# EAGLE design C64_Kernal_Switch (EAGLE 9.2.2)
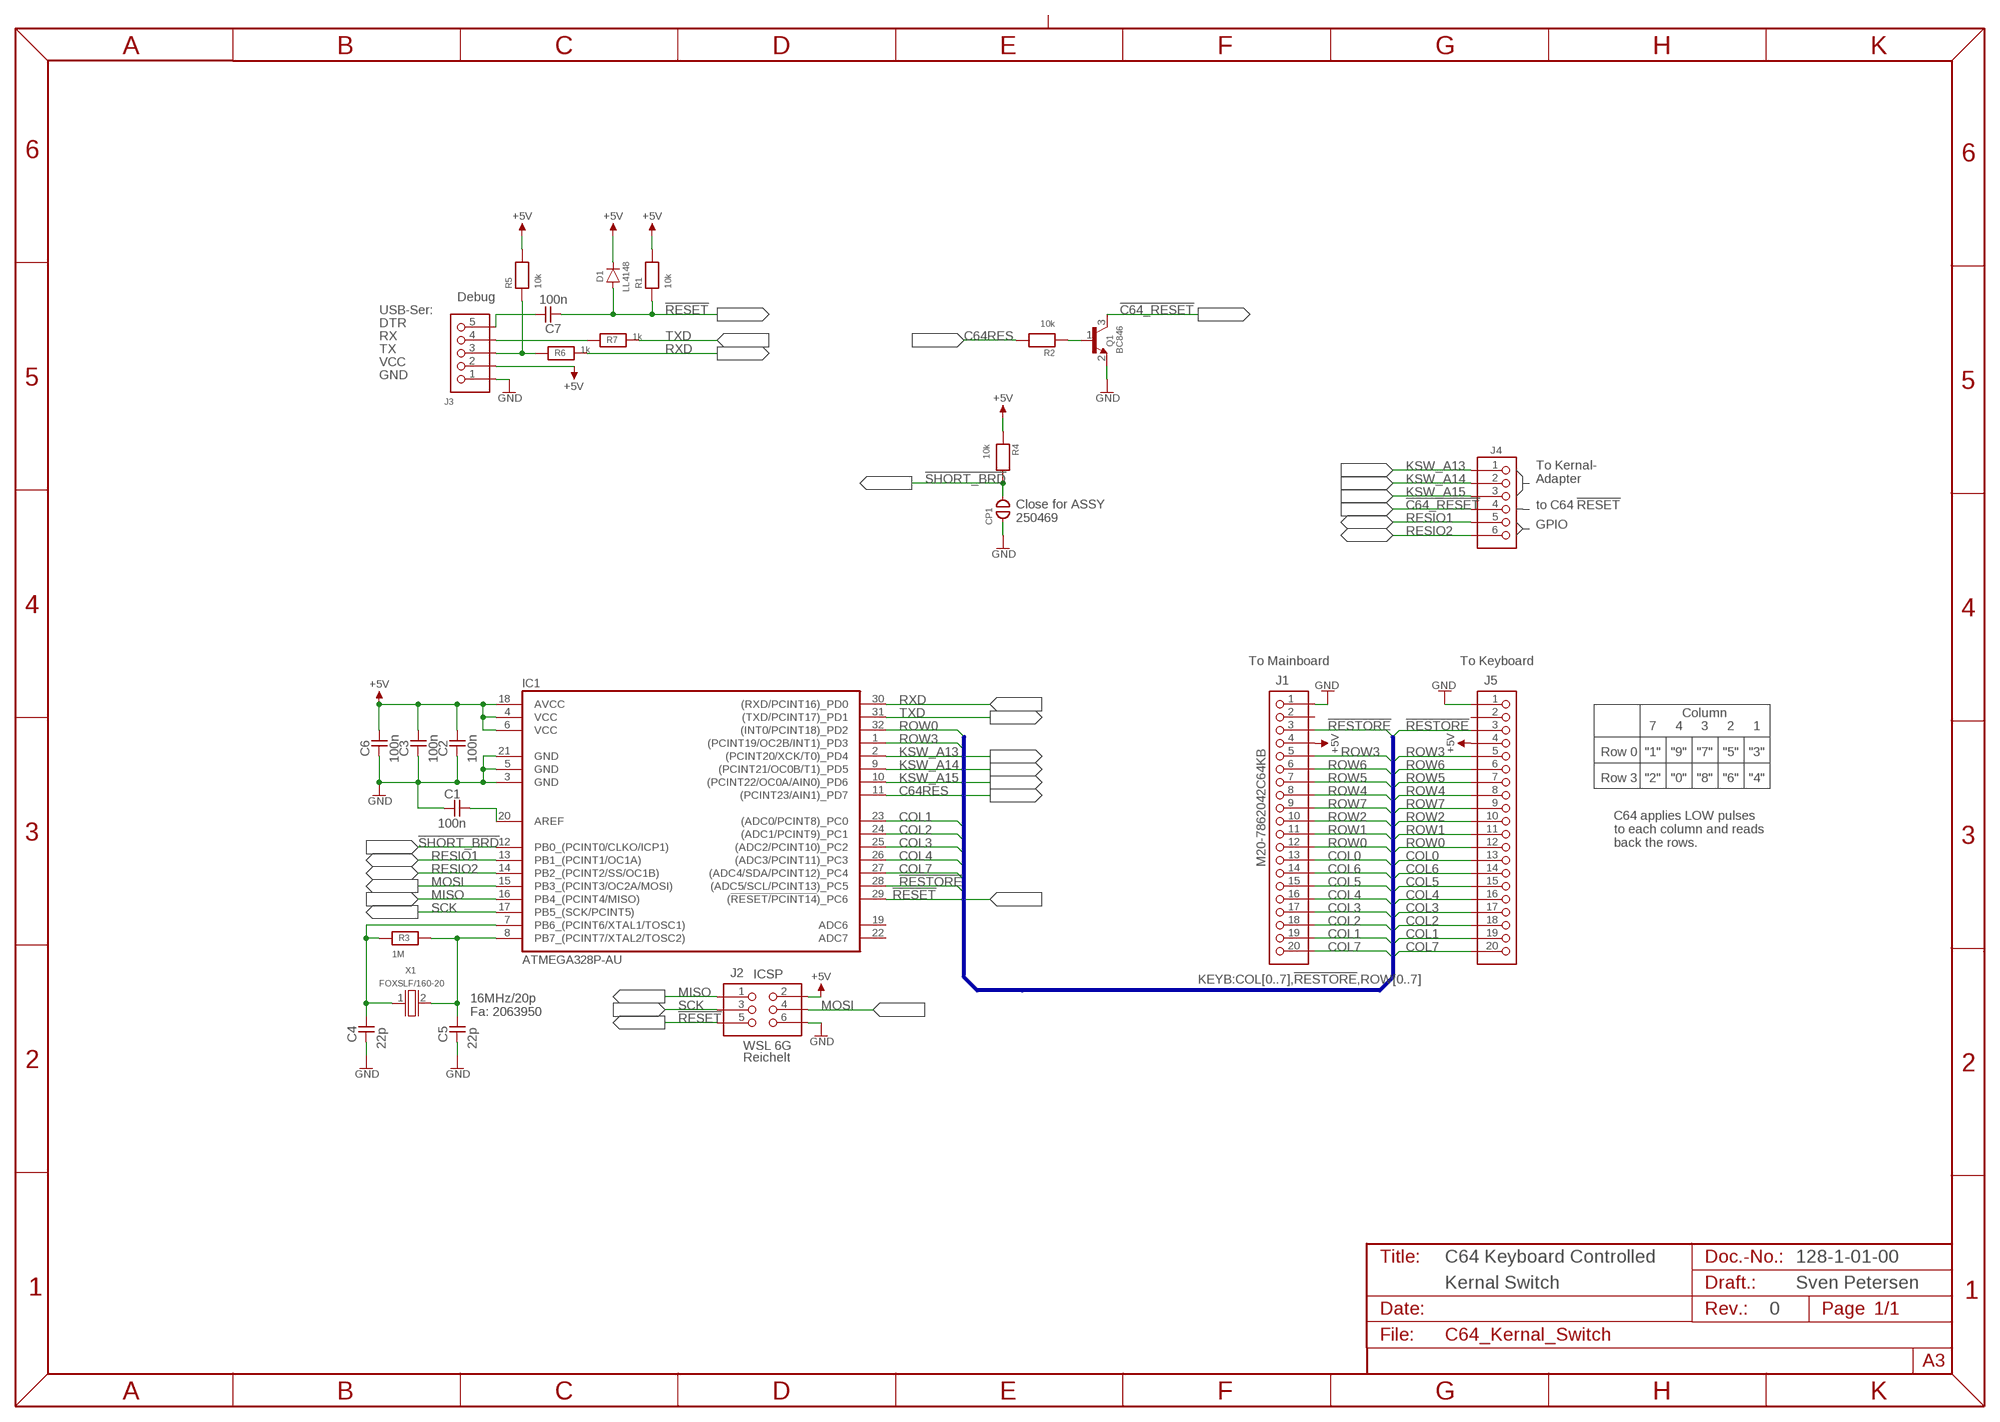
[diagram p0: schematic, sheet 1]

## Parts
C1  100n  C-0805  [0805]
C2  100n  C-0805  [0805]
C3  100n  C-0805  [0805]
C4  22p  C-0805  [0805]
C5  22p  C-0805  [0805]
C6  100n  C-0805  [0805]
C7  100n  C-0805  [0805]
CP1  OPEN  [CP_OP]
D1  LL4148  [SOD80C]
IC1  ATMEGA328P-AU  ATMEGA328-AU  [QFP80P900X900X120-32N]
J1  M20-7862042C64KB  [C64_KEYBOARD]
J2  WSL 6G  2X03WV  [2X03WV]
J3  n/a  PINHD-1X5  [1X05]
J4  PINHD-1X6  [1X06]
J5  PINHD-1X20  [1X20]
Q1  BC846  [SOT23]
R1  10k  R-0805  [0805]
R2  10k  R-0805  [0805]
R3  1M  R-0805  [0805]
R4  10k  R-0805  [0805]
R5  10k  R-0805  [0805]
R6  1k  R-0805  [0805]
R7  1k  R-0805  [0805]
X1  FOXSLF/160-20  HC49SLF  [HC49SLF]

## Nets
!C64_RESET: J4.4 Q1.3(C)
!RESET: C7.1 D1.A IC1.29((!RESET/PCINT14!)_PC6) J2.5 R1.1
!RESTORE: IC1.28((ADC5/SCL/PCINT13)_PC5) J1.3 J5.3
!SHORT_BRD: CP1.2 IC1.12(PB0_(PCINT0/CLKO/ICP1)) R4.2
+5V: C2.2 C3.2 C6.2 D1.K IC1.4(VCC) IC1.6(VCC) IC1.18(AVCC) J1.4 J2.2 J3.2 J5.4 R1.2 R4.1 R5.2
C64RES: IC1.11((PCINT23/AIN1)_PD7) R2.2
COL0: J1.13 J5.13
COL1: IC1.23((ADC0/PCINT8)_PC0) J1.19 J5.19
COL2: IC1.24((ADC1/PCINT9)_PC1) J1.18 J5.18
COL3: IC1.25((ADC2/PCINT10)_PC2) J1.17 J5.17
COL4: IC1.26((ADC3/PCINT11)_PC3) J1.16 J5.16
COL5: J1.15 J5.15
COL6: J1.14 J5.14
COL7: IC1.27((ADC4/SDA/PCINT12)_PC4) J1.20 J5.20
GND: C1.1 C2.1 C3.1 C4.1 C5.1 C6.1 CP1.1 IC1.3(GND) IC1.5(GND) IC1.21(GND) J1.1 J2.6 J3.1 J5.1 Q1.2(E)
KSW_A13: IC1.2((PCINT20/XCK/T0)_PD4) J4.1
KSW_A14: IC1.9((PCINT21/OC0B/T1)_PD5) J4.2
KSW_A15: IC1.10((PCINT22/OC0A/AIN0)_PD6) J4.3
MISO: IC1.16(PB4_(PCINT4/MISO)) J2.1
MOSI: IC1.15(PB3_(PCINT3/OC2A/MOSI)) J2.4
N$1: C4.2 IC1.7(PB6_(PCINT6/XTAL1/TOSC1)) R3.1 X1.1
N$2: C5.2 IC1.8(PB7_(PCINT7/XTAL2/TOSC2)) R3.2 X1.2
N$3: C1.2 IC1.20(AREF)
N$7: Q1.1(B) R2.1
N$26: C7.2 J3.5
N$27: J3.4 R7.1
N$28: J3.3 R5.1 R6.1
RESIO1: IC1.13(PB1_(PCINT1/OC1A)) J4.5
RESIO2: IC1.14(PB2_(PCINT2/SS/OC1B)) J4.6
ROW0: IC1.32((INT0/PCINT18)_PD2) J1.12 J5.12
ROW1: J1.11 J5.11
ROW2: J1.10 J5.10
ROW3: IC1.1((PCINT19/OC2B/INT1)_PD3) J1.5 J5.5
ROW4: J1.8 J5.8
ROW5: J1.7 J5.7
ROW6: J1.6 J5.6
ROW7: J1.9 J5.9
RXD: IC1.30((RXD/PCINT16)_PD0) R6.2
SCK: IC1.17(PB5_(SCK/PCINT5)) J2.3
TXD: IC1.31((TXD/PCINT17)_PD1) R7.2
Unconnected: IC1.19(ADC6) IC1.22(ADC7) J1.2 J5.2

## Buses
KEYB:COL[0..7],!RESTORE,ROW[0..7]

## Notes on the sheet
- Debug
- USB-Ser:
- DTR
- RX
- TX
- VCC
- GND
- To Kernal-
  Adapter
- to C64 !RESET
- Close for ASSY
  250469
- GPIO
- To Mainboard | To Keyboard
- Column
- 7 | 4 | 3 | 2 | 1
- Row 0 | "1" | "9" | "7" | "5" | "3"
- Row 3 | "2" | "0" | "8" | "6" | "4"
- C64 applies LOW pulses
  to each column and reads 
  back the rows.
- ICSP
- 16MHz/20p
  Fa: 2063950
- Reichelt
- C64 Keyboard Controlled | 128-1-01-00
- Kernal Switch | Sven Petersen
- 0

## Library data of the parts
C1-C7 = SMD:C-0805
CP1 = Cutpad:OPEN: open Cutpad
D1 = Dioden:LL4148
IC1 = Atmel:ATMEGA328-AU: MCU, 8BIT, AVR, 32K FLASH, TQFP-32; DIST: Fa: 2443176; MPN: ATMEGA328-AU; OC_FARNELL: 1972086; OC_NEWARK: 68T2926; PACKAGE: TQFP-32; SUPPLIER: ATMEL
J1 = HARWIN:M20-7862042; SPICEPREFIX: X
J2 = PINHEAD:2X03WV; DIST: Reichelt: WSL 6G
J3 = PINHEAD:PINHD-1X5
J4 = PINHEAD:PINHD-1X6
J5 = PINHEAD:PINHD-1X20
Q1 = Transistoren:BC846
R1-R7 = SMD:R-0805
X1 = FOX:HC49SLF; DIST: 16MHz/20p, Fa: 2063950

## Board
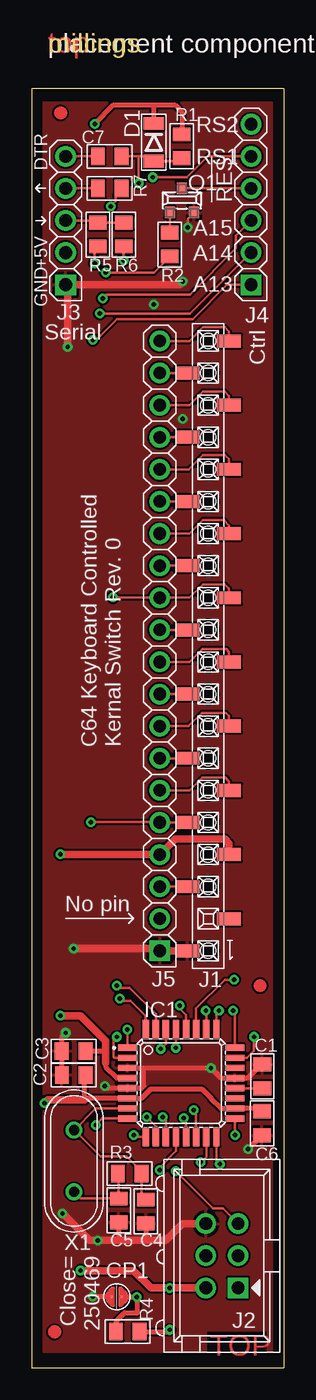
[diagram p1: board, top side]
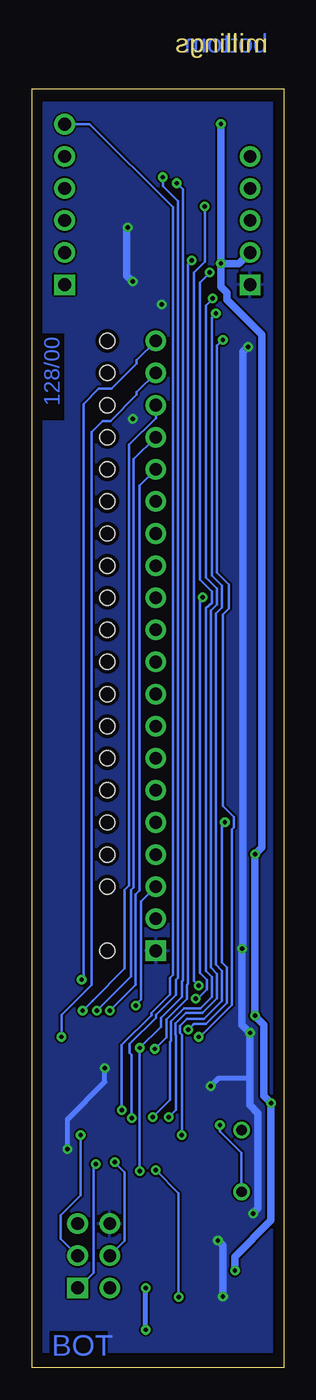
[diagram p2: board, bottom side, seen from below]

Size 20 x 101.2 mm. Coordinates in mm from the lower left corner, seen from the top.
Outline: 0,0 20,0 20,101.2 0,101.2 0,93 0,0
Copper layers (1*16): Top 0.035mm / dielectric 1.5mm / Bottom 0.035mm
Design rules "default *": minimum track width 6mil, minimum drill 0.35mm, track to track 6mil, track to pad 6mil, pad to pad 6mil, via to via 6mil, smd to smd 6mil, copper to edge 12.5mil, drill to drill 6mil, minimum pad ring 10mil, minimum via ring 8mil, stop-mask expansion 4mil, vias tented up to drill 25mil, thermal gap 10mil
bRestrict: 4 lines

### Footprints (pad centres in the part's own frame; a part is rotated, then mirrored left to right if it is on the bottom)
0805 = smd 1.092 x 1.397: 1 -0.94,0; 2 0.94,0
CP_OP = smd 0.152 x 0.152: 1 -0.4,0; 2 0.4,0
SOD80C = smd 1 x 1.6: A -1.5,0; K 1.5,0
QFP80P900X900X120-32N = smd 1.5 x 0.5: 1 -4.25,2.8; 2 -4.25,2; 3 -4.25,1.2; 4 -4.25,0.4; 5 -4.25,-0.4; 6 -4.25,-1.2; 7 -4.25,-2; 8 -4.25,-2.8; 17 4.25,-2.8; 18 4.25,-2; 19 4.25,-1.2; 20 4.25,-0.4; 21 4.25,0.4; 22 4.25,1.2; 23 4.25,2; 24 4.25,2.8 | smd 0.5 x 1.5: 9 -2.8,-4.25; 10 -2,-4.25; 11 -1.2,-4.25; 12 -0.4,-4.25; 13 0.4,-4.25; 14 1.2,-4.25; 15 2,-4.25; 16 2.8,-4.25; 25 2.8,4.25; 26 2,4.25; 27 1.2,4.25; 28 0.4,4.25; 29 -0.4,4.25; 30 -1.2,4.25; 31 -2,4.25; 32 -2.8,4.25
C64_KEYBOARD = smd 1.02 x 1.9: 1 -24.13,1.65; 2 -21.59,-1.65; 3 -19.05,1.65; 4 -16.51,-1.65; 5 -13.97,1.65; 6 -11.43,-1.65; 7 -8.89,1.65; 8 -6.35,-1.65; 9 -3.81,1.65; 10 -1.27,-1.65; 11 1.27,1.65; 12 3.81,-1.65; 13 6.35,1.65; 14 8.89,-1.65; 15 11.43,1.65; 16 13.97,-1.65; 17 16.51,1.65; 18 19.05,-1.65; 19 21.59,1.65; 20 24.13,-1.65 | hole 1.2: -1.27,0; -3.81,0; -6.35,0; -8.89,0; -11.43,0; -13.97,0; -16.51,0; -19.05,0; -24.13,0; 1.27,0; 3.81,0; 6.35,0; 8.89,0; 11.43,0; 13.97,0; 16.51,0; 19.05,0; 21.59,0; 24.13,0
2X03WV = drill 1 pad 1.626 square: 1 -2.54,-1.27 | drill 1 pad 1.626: 2 -2.54,1.27; 3 0,-1.27; 4 0,1.27; 5 2.54,-1.27; 6 2.54,1.27
1X05 = drill 1 pad 1.626 square: 1 -5.08,0 | drill 1 pad 1.626: 2 -2.54,0; 3 0,0; 4 2.54,0; 5 5.08,0
1X06 = drill 1 pad 1.626 square: 1 -6.35,0 | drill 1 pad 1.626: 2 -3.81,0; 3 -1.27,0; 4 1.27,0; 5 3.81,0; 6 6.35,0
1X20 = drill 1 pad 1.626 square: 1 -24.13,0 | drill 1 pad 1.626: 2 -21.59,0; 3 -19.05,0; 4 -16.51,0; 5 -13.97,0; 6 -11.43,0; 7 -8.89,0; 8 -6.35,0; 9 -3.81,0; 10 -1.27,0; 11 1.27,0; 12 3.81,0; 13 6.35,0; 14 8.89,0; 15 11.43,0; 16 13.97,0; 17 16.51,0; 18 19.05,0; 19 21.59,0; 20 24.13,0
SOT23 = smd 0.8 x 0.9: 1 -0.953,-0.953; 2 0.953,-0.953; 3 0,0.953
HC49SLF = drill 0.8: 1 -2.44,0; 2 2.44,0

### Placement (x,y rotation side)
C1  18.28,23.07 270 top
C2  3.34,23.17 0 top
C3  3.33,25.07 0 top
C4  9.05,12.38 90 top
C5  6.91,12.46 90 top
C6  18.26,19.35 90 top
C7  6.19,95.87 180 top
CP1  6.75,5.62 0 top
D1  9.68,96.98 90 top
IC1  11.84,22.53 0 top
J1  14,57.13 90 top
J2  15.08,8.88 90 top
J3  2.7,90.79 90 top
J4  17.38,92.06 90 top
J5  10.16,57.13 90 top
Q1  11.91,92.38 0 top
R1  11.91,96.66 90 top
R2  10.95,88.89 270 top
R3  7.78,15.38 180 top
R4  7.62,2.87 180 top
R5  5.24,89.68 270 top
R6  7.3,89.68 270 top
R7  6.19,93.33 0 top
U$44  [2LAYER]  14.13,0.95 0 top
U$45  [SMD_REF_R1MM]  2.3,99.3 0 top
U$46  [SMD_REF_R1MM]  18.1,30.24 0 top
U$47  [SMD_REF_R1MM]  1.83,2.86 0 top
U$52  [PCB-TITLE/]  0,102.79 0 top
X1  3.36,16.37 270 top

### Tracks (layer width: path | path; a pad name or v marks a point on that pad's centre or on a via)
!C64_RESET
  Top 0.203: Q1.3 J4.4
!RESET  (via drill 0.35)
  Top 0.203: C7.1 8.49,95.87 | 8.49,95.87 9.29,95.87 D1.A 11.66,95.48 R1.1 | J2.5 15.15,12.62 14.37,12.62 v11.43,15.56 | v11.43,25.32 IC1.29 | v8.49,93.74 8.49,95.87
  Bottom 0.203: v11.43,15.56 v11.43,25.32 9.76,26.99 9.76,27.7 8.1,29.37 8.1,30.59 8.02,30.66 8.02,93.27 v8.49,93.74
!RESTORE  (via drill 0.35)
  Top 0.203: J5.3 J1.3 | IC1.28 12.22,26.8 12.22,27.94 11.63,28.54 v11.75,28.65
  Bottom 0.203: 10.14,38.08 J5.3 11.31,36.93 11.31,29.14 11.75,28.71 v11.75,28.65
!SHORT_BRD  (via drill 0.35)
  Top 0.203: IC1.12 11.44,17.16 10.16,15.88 v10.16,15.64
  Top 0.406: CP1.2 v8.35,5.62 8.41,5.56 8.41,4.37 7.38,4.37 6.75,3.73 6.75,2.94 R4.2
  Bottom 0.203: v8.35,5.62 8.35,6.13 8.35,13.83 v10.16,15.64
+5V  (via drill 0.35)
  Top 0.203: v5,87.39 5,88.5 R5.2
  Top 0.406: IC1.4 6.77,22.93 5.87,23.83 5.87,24.13 | C6.2 18.02,20.53 IC1.18 15.03,20.53 14.23,21.33 14.21,21.35 13.49,22.07 9.45,22.07 8.71,21.33 IC1.6 4.35,21.33 4.21,21.19 4.21,23.1 C2.2 | R4.1 8.57,2.86 10.79,2.86 v10.95,3.02 | v5,98.42 6.51,99.93 9.6,99.93 | R1.2 11.91,99.38 11.35,99.93 9.6,99.93 | D1.K 9.68,99.85 9.6,99.93 | C3.2 5.81,25.07 5.87,25
  Top 0.61: J1.4 15.65,41.5 15.31,41.84 11.38,41.84 J5.4 10.14,40.64 v2.3,40.64 | J2.2 v10.95,6.33 9.46,6.33 8.1,7.7 v3.89,7.7 | v1.03,20.95 1.27,21.19 4.21,21.19 | v2.3,27.86 3.89,27.86 5.87,25.88 5.87,25 5.87,24.13
  Bottom 0.406: v10.95,3.02 v10.95,6.33 | v10.95,6.33 10.95,6.35 v10.95,6.33
  Bottom 0.61: v3.89,7.7 3.89,8.81 1.03,11.67 v1.03,20.95 1.59,21.51 1.59,27.15 v2.3,27.86 2.3,40.16 v2.3,40.64 1.75,41.2 1.75,81.76 4.52,84.53 4.52,85.09 5,85.57 v5,87.39 | v5,87.39 v5,98.42 | J3.2 2.71,88.25 3.57,87.39 v5,87.39
C64RES  (via drill 0.35)
  Top 0.203: IC1.11 10.64,19.6 v10.4,19.84 | v5.87,86.68 9.69,86.68 R2.2
  Bottom 0.203: v10.4,19.84 9.05,21.19 9.05,25.8 8.97,25.88 8.97,27.41 7.93,28.45 6.63,28.45 5.71,29.37 5.71,30.96 6.19,31.43 6.19,60.14 5.71,60.54 5.71,61.44 6.67,62.39 6.67,85.88 v5.87,86.68
COL0
  Top 0.203: J1.13 J5.13
COL1  (via drill 0.35)
  Top 0.203: J1.19 J5.19 | IC1.23 17.07,24.53 17.46,24.92 17.62,25.08 v17.62,26.19
  Bottom 0.203: v17.62,26.19 17.62,27.94 15.24,30.32 15.24,74.06 14.37,74.93 13.73,74.93 11.67,76.99 11.67,77.21 J5.19
COL2  (via drill 0.35)
  Top 0.203: J5.18 12.52,76.18 13.57,77.23 15.32,77.23 15.65,76.9 J1.18 | IC1.24 16.09,28.12 v15.95,28.26
  Bottom 0.203: J5.18 10.16,75.15 12.26,73.05 12.26,38.17 12.62,37.81 12.62,31.59 15.16,29.05 v15.95,28.26
COL3  (via drill 0.35)
  Top 0.203: J5.17 J1.17 | IC1.25 14.64,28.06 v14.84,28.26
  Bottom 0.203: v14.84,28.26 12.1,31 12.1,37.82 11.91,38.02 11.91,71.89 J5.17
COL4  (via drill 0.35)
  Top 0.203: J5.16 12.44,71.1 13.57,72.23 15.32,72.23 15.65,71.9 J1.16 | v13.81,28.26 13.84,28.23 IC1.26
  Bottom 0.203: v13.81,28.26 11.75,30.32 11.75,37.47 11.43,37.78 11.43,69.83 J5.16
COL5
  Top 0.203: J5.15 J1.15
COL6
  Top 0.203: J5.14 12.52,66.02 13.59,67.09 15.22,67.09 15.65,66.66 J1.14
COL7  (via drill 0.35)
  Top 0.203: J5.20 12.52,81.26 13.59,82.33 15.3,82.33 15.65,81.98 J1.20 | IC1.27 13.04,28.44 15.32,30.72 v16.03,30.72
  Bottom 0.203: J5.20 11.67,79.75 11.67,79.45 13.65,77.47 14.68,77.47 15.88,76.28 15.88,30.72 v16.03,30.72
GND  (via drill 0.35)
  Top 0.203: v12.38,90.25 12.38,90.95 Q1.2
  Top 0.406: C2.1 C3.1 2.39,26.21 v2.7,26.51 | C1.1 18.21,24.01 17.14,22.93 IC1.21 15.01,22.93 v14.21,23.73 8.89,23.73 | IC1.3 8.89,23.73 | C5.1 6.91,10.16 6.83,10.08 | C4.1 9.05,10.17 8.97,10.08 | CP1.1 4.94,5.62 4.92,5.64 v4.84,5.64 | 8.89,23.73 8.89,22.3 8.73,22.15 7.6,22.15 IC1.5 6.04,22.13 5.87,22.3 v5.79,22.3 | C6.1 v17.15,17.3 v17.14,17.3
  Top 0.61: J1.1 J5.1 9.98,33.18 v3.33,33.18 | J2.6 11.97,11.41 10.64,10.08 8.97,10.08 6.83,10.08 v5.24,10.08 4.6,10.08 v2.46,12.22 | v2.86,80.8 2.86,85.55 J3.1 11.73,85.71 v11.99,85.96
  Bottom 0.203: 12.46,90.25 v12.38,90.25
  Bottom 0.406: v5.79,22.3 5.16,22.94 2.7,22.94 | v17.14,17.3 17.14,19.68 14.21,22.62 v14.21,23.73
  Bottom 0.61: v4.84,5.64 4.84,9.68 v5.24,10.08 | v2.46,12.22 2.06,12.62 2.06,20.16 2.7,20.8 2.7,22.94 v2.7,26.51 3.33,27.15 v3.33,33.18 3.25,33.26 3.25,42.7 3.25,80.41 v2.86,80.8 | v11.99,85.96 12.46,86.44 12.46,90.25
  other vias: 11.99,75.09 9.68,84.14
  pour Top: 1.35,1.27 19.05,1.27 19.05,8.73 19.05,100.09 0.95,100.09 0.95,1.27 1.27,1.27
  pour Bottom: 0.95,1.27 19.05,1.27 19.05,100.09 0.95,100.09
KSW_A13  (via drill 0.35)
  Top 0.203: IC1.2 6.58,24.53 6.51,24.61 6.51,26.04 6.67,26.19 v6.75,26.19 | v4.84,81.36 5.16,81.36 6.79,82.99 12.77,82.99 15.49,85.71 J4.1
  Bottom 0.203: v6.75,26.19 6.67,26.19 4.13,28.73 4.13,42.62 3.97,42.78 3.97,43.58 4.84,44.45 4.84,59.61 4.37,60.09 4.37,61.99 5.32,62.94 5.32,80.88 v4.84,81.36
KSW_A14  (via drill 0.35)
  Top 0.203: IC1.9 8.23,18.28 v8.1,18.41 | v5.4,83.42 12.55,83.42 J4.2
  Bottom 0.203: v8.1,18.41 8.1,26.35 8.26,26.51 8.26,27.07 7.7,27.62 6.35,27.62 4.92,29.05 4.92,31.43 5.4,31.91 5.4,59.69 4.92,60.17 4.92,61.91 5.71,62.71 5.71,83.11 v5.4,83.42
KSW_A15  (via drill 0.35)
  Top 0.203: IC1.10 9.84,19.13 v9.13,19.84 | v5.64,84.61 5.95,84.93 12.54,84.93 16.19,88.58 16.19,89.6 J4.3
  Bottom 0.203: v9.13,19.84 8.57,20.4 8.57,26.33 8.61,26.36 8.61,27.27 7.78,28.1 6.46,28.1 5.32,29.24 5.32,31.19 5.79,31.67 5.79,59.93 5.32,60.4 5.32,61.67 6.19,62.55 6.19,84.06 v5.64,84.61
MISO  (via drill 0.35)
  Top 0.203: IC1.16 14.64,16.39 v14.92,16.11
  Bottom 0.203: v14.92,16.11 15.08,15.95 15.08,7.54 16.29,6.33 J2.1
MOSI  (via drill 0.35)
  Top 0.203: IC1.15 13.84,16.7 v13.41,16.27
  Bottom 0.203: v13.41,16.27 12.62,15.48 12.62,10.07 J2.4
N$1
  Top 0.203: IC1.7 5.08,20.53 X1.1 3.41,18.81 5.48,16.75 7.51,16.75 8.72,15.54 R3.1 8.72,13.66 C4.2
N$2  (via drill 0.35)
  Top 0.203: v5.08,19.21 5.61,19.73 IC1.8 | R3.2 6.91,15.31 C5.2 3.89,13.4 X1.2
  Bottom 0.203: X1.2 3.36,17.01 5.08,18.73 v5.08,19.21
N$3
  Top 0.203: IC1.20 C1.2
N$7
  Top 0.203: R2.1 Q1.1
N$26
  Top 0.203: J3.5 C7.2
N$27
  Top 0.203: J3.4 R7.1
N$28
  Top 0.203: J3.3 5.07,90.79 R5.1 R6.1
RESIO1  (via drill 0.35)
  Top 0.203: IC1.13 12.24,19.59 v12.06,19.76 | v9.6,94.22 12.3,94.22 13.97,95.89 17.36,95.89 J4.5
  Bottom 0.203: v12.06,19.76 12.06,24.77 12.22,24.92 12.22,25.64 10.16,27.7 10.16,27.94 8.57,29.53 8.57,30.72 8.41,30.88 8.41,92.31 9.6,93.5 v9.6,94.22
RESIO2  (via drill 0.35)
  Top 0.203: IC1.14 13.04,20.22 v12.86,20.4
  Bottom 0.203: v12.86,20.4 12.86,25.56 10.52,27.9 10.52,28.09 9.05,29.55 9.05,30.85 8.81,31.09 8.81,91.84 15.38,98.41 J4.6
ROW0  (via drill 0.35)
  Top 0.203: J1.12 15.65,61.66 15.32,61.99 13.57,61.99 12.52,60.94 J5.12 10.11,60.99 10.08,60.96 v6.43,60.96 | IC1.32 9.04,27.87 7.86,29.05 7.06,29.05 6.99,29.13 v6.99,29.21
  Bottom 0.203: v6.99,29.21 6.85,29.21 6.11,29.94 6.11,30.72 6.67,31.27 6.67,43.81 6.67,45.72 6.67,60.72 v6.43,60.96
ROW1
  Top 0.203: J1.11 J5.11
ROW2
  Top 0.203: J5.10 12.52,55.86 13.54,56.88 15.43,56.88 15.65,56.66 J1.10
ROW3  (via drill 0.35)
  Top 0.203: J1.5 J5.5 10.14,43.18 v4.68,43.18 | IC1.1 v7.59,26.78
  Bottom 0.203: v7.59,26.78 7.22,27.15 7.14,27.23 6.19,27.23 4.52,28.89 4.52,31.67 4.92,32.07 4.92,42.94 v4.68,43.18
ROW4
  Top 0.203: J5.8 12.44,50.78 13.49,51.83 15.4,51.83 15.65,51.58 J1.8
ROW5
  Top 0.203: J5.7 J1.7
ROW6
  Top 0.203: J5.6 12.52,45.7 13.54,46.72 15.35,46.72 15.65,46.42 J1.6
ROW7
  Top 0.203: J5.9 J1.9
RXD  (via drill 0.35)
  Top 0.203: IC1.30 10.64,25.64 v10.24,25.24 | R6.2 v7.3,87.63
  Bottom 0.203: v10.24,25.24 9.32,26.16 9.32,27.56 7.7,29.18 7.7,30.32 7.62,30.4 7.62,87.34 7.33,87.63 v7.3,87.63
SCK  (via drill 0.35)
  Top 0.203: v16.11,18.41 16.11,19.71 IC1.17
  Bottom 0.203: J2.3 17.7,10.22 17.7,12.06 16.11,13.65 v16.11,18.41
TXD  (via drill 0.35)
  Top 0.203: IC1.31 9.84,28.02 7.78,30.08 6.93,30.08 v6.76,30.25 | v6.27,91.92 6.67,92.31 6.67,92.87 R7.2
  Bottom 0.203: v6.76,30.25 7.14,30.64 7.14,86.68 6.27,87.55 v6.27,91.92

### Text on the board
Bottom: 128/00
tPlace: RS2 | DTR | RS1 | !RES | A15 | A14 | +5V | A13 | GND | Serial | Ctrl | C64 Keyboard Controlled / Kernal Switch Rev. 0 | No pin | Close= / 250469
tValues: 16MHz/20p
Document: 128-2-01-00 | Sven Petersen / 2019 | 35µm | 2 | 0